# EAGLE schematic buzzer 12v limiter (EAGLE 7.5.0)
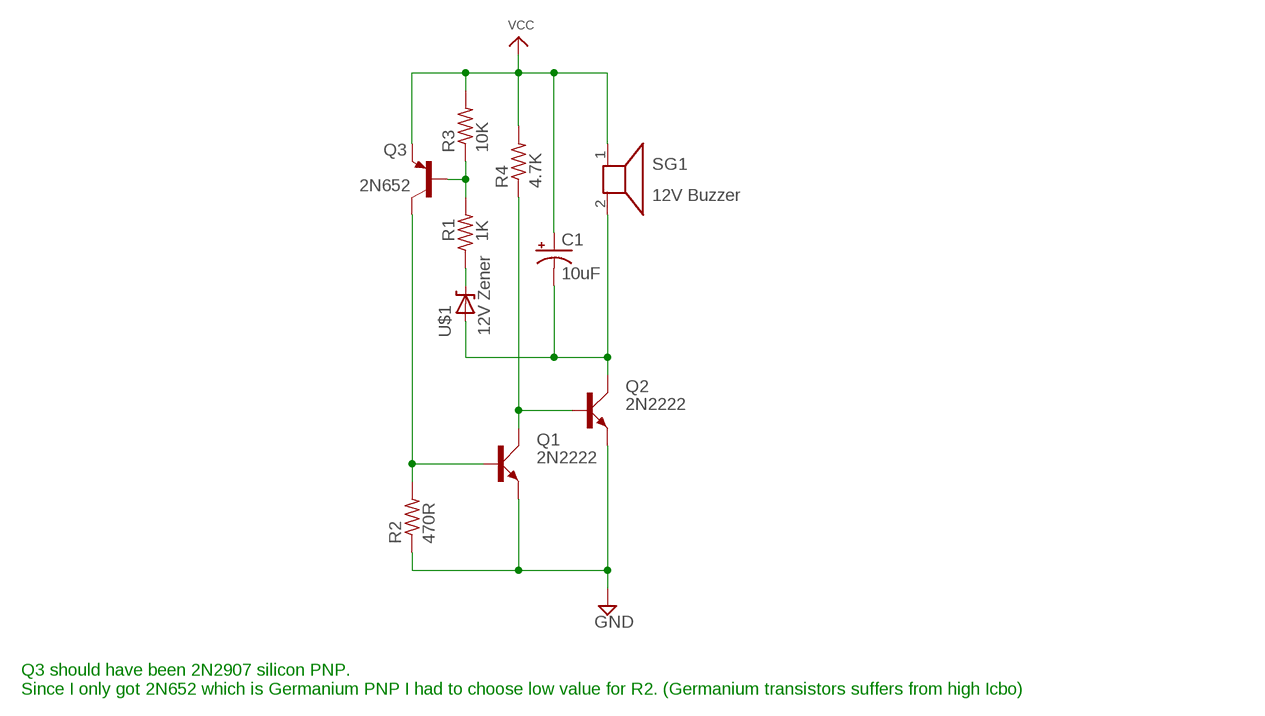
[diagram p0: schematic, sheet 1]

## Parts
C1  10uF  100UF-63V-20%(ELECT)  [PANASONIC_H13]
Q1  2N2222  [TO18A]
Q2  2N2222  [TO18A]
Q3  2N652  2N2907  [TO18]
R1  1K  FLIPFLOP-RES  [0805-THM]
R2  470R  FLIPFLOP-RES  [0805-THM]
R3  10K  FLIPFLOP-RES  [0805-THM]
R4  4.7K  FLIPFLOP-RES  [0805-THM]
SG1  12V Buzzer  F/SMX  [F/SMX]
U$1  12V Zener  DIODE-ZENERPTH  [DIODE-ZENER]

## Nets
GND: Q1.E Q2.E R2.1
N$2: Q1.C Q2.B R4.1
N$3: C1.- Q2.C SG1.2 U$1.P$2(A)
N$5: Q3.2(B) R1.2 R3.1
N$6: R1.1 U$1.P$1(C)
N$7: Q1.B Q3.3(C) R2.2
VCC: C1.+ Q3.1(E) R3.2 R4.2 SG1.1

## Notes on the sheet
- Q3 should have been 2N2907 silicon PNP.
  Since I only got 2N652 which is Germanium PNP I had to choose low value for R2. (Germanium transistors suffers from high Icbo)

## Library data of the parts
C1 = SparkFun-Capacitors:100UF-63V-20%(ELECT): CAP-08362 100uF electrolytic SMT 63V 20%; PROD_ID: CAP-08362; VALUE: 100uF
Q1 Q2 = transistor-small-signal:2N2222: NPN TRANSISTOR
Q3 = transistor-pnp:2N2907*: PNP Transistor
R1-R4 = adafruit:FLIPFLOP-RES: Flip Flop resistor An 0805 resistor inside a standard 1/4W 5% resistor. Makes for easy mods
SG1 = buzzer:F/SMX: BUZZER Source: Buerklin; OC_FARNELL: unknown; OC_NEWARK: unknown
U$1 = SparkFun-DiscreteSemi:DIODE-ZENER: Zener Diode Production Part - 8199 3.4V Zener Voltage